# EAGLE design muxi (EAGLE 9.0.0)
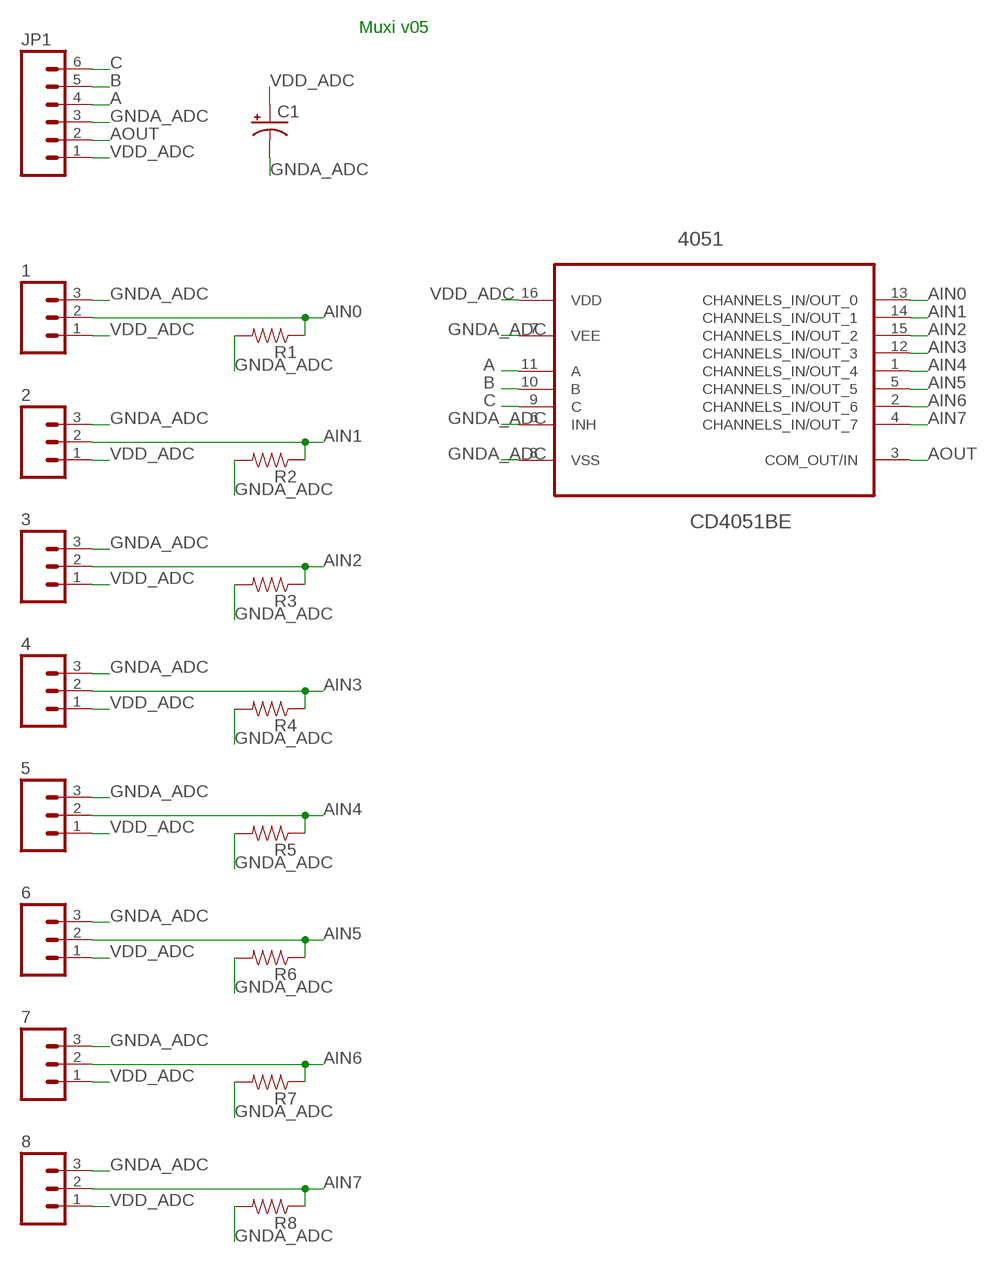
[diagram p0: schematic, sheet 1]

## Parts
1  M03PTH  [1X03]
2  M03PTH  [1X03]
3  M03PTH  [1X03]
4  M03PTH  [1X03]
5  M03PTH  [1X03]
6  M03PTH  [1X03]
7  M03PTH  [1X03]
8  M03PTH  [1X03]
4051  CD4051BE  [DIP254P762X508-16]
C1  CAP_POLPTH2  [CPOL-RADIAL-10UF-25V]
JP1  M06NO_SILK  [1X06_NO_SILK]
R1  RESISTORAXIAL-0.3  [AXIAL-0.3]
R2  RESISTORAXIAL-0.3  [AXIAL-0.3]
R3  RESISTORAXIAL-0.3  [AXIAL-0.3]
R4  RESISTORAXIAL-0.3  [AXIAL-0.3]
R5  RESISTORAXIAL-0.3  [AXIAL-0.3]
R6  RESISTORAXIAL-0.3  [AXIAL-0.3]
R7  RESISTORAXIAL-0.3  [AXIAL-0.3]
R8  RESISTORAXIAL-0.3  [AXIAL-0.3]

## Nets
A: 4051.11(A) JP1.4
AIN0: 1.2 4051.13(CHANNELS_IN/OUT_0) R1.P$1
AIN1: 2.2 4051.14(CHANNELS_IN/OUT_1) R2.P$1
AIN2: 3.2 4051.15(CHANNELS_IN/OUT_2) R3.P$1
AIN3: 4.2 4051.12(CHANNELS_IN/OUT_3) R4.P$1
AIN4: 5.2 4051.1(CHANNELS_IN/OUT_4) R5.P$1
AIN5: 6.2 4051.5(CHANNELS_IN/OUT_5) R6.P$1
AIN6: 7.2 4051.2(CHANNELS_IN/OUT_6) R7.P$1
AIN7: 8.2 4051.4(CHANNELS_IN/OUT_7) R8.P$1
AOUT: 4051.3(COM_OUT/IN) JP1.2
B: 4051.10(B) JP1.5
C: 4051.9(C) JP1.6
GNDA_ADC: 1.3 2.3 3.3 4.3 5.3 6.3 7.3 8.3 4051.6(INH) 4051.7(VEE) 4051.8(VSS) C1.2(-) JP1.3 R1.P$2 R2.P$2 R3.P$2 R4.P$2 R5.P$2 R6.P$2 R7.P$2 R8.P$2
VDD_ADC: 1.1 2.1 3.1 4.1 5.1 6.1 7.1 8.1 4051.16(VDD) C1.1(+) JP1.1

## Notes on the sheet
- Muxi v05

## Library data of the parts
1-8 = SparkFun-Connectors:M03: Header 3 Standard 3-pin 0.1" header. Use with straight break away headers (SKU : PRT-00116), right angle break away headers (PRT-00553), swiss pins (PRT-00743), machine pins (PRT-00117), and female headers (PRT-00115). Molex polarized connector foot print use with SKU : PRT-08232 with associated crimp pins and housings.
4051 = my4051:CD4051BE: The CD4051B is a single 8-Channel multiplexer having three binary control inputs.; MPN: CD4051BE; OC_FARNELL: 2135100; OC_NEWARK: 60K5119; PACKAGE: PDIP-16; SUPPLIER: Texas Instruments
C1 = SparkFun-Capacitors:CAP_POL: Capacitor Polarized These are standard SMD and PTH capacitors. Normally 10uF, 47uF, and 100uF in electrolytic and tantalum varieties. Always verify the external diameter of the through hole cap, it varies with capacity, voltage, and manufacturer. The EIA devices should be standard.
JP1 = SparkFun-Connectors:M06: Header 6 Standard 6-pin 0.1" header. Use with straight break away headers (SKU : PRT-00116), right angle break away headers (PRT-00553), swiss pins (PRT-00743), machine pins (PRT-00117), and female headers (PRT-00115). Molex polarized connector foot print use with SKU : PRT-08094 with associated crimp pins and housings. NOTES ON THE VARIANTS LOCK and LOCK_LONGPADS... This footprint was designed to help hold the alignment of a through-hole component (i.e. 6-pin header) while soldering it into place. You may notice that each hole has been shifted either up or down by 0.005 of an inch from it's more standard position (which is a perfectly straight line). This slight alteration caused the pins (the squares in the middle) to touch the edges of the holes. Because they are alternating, it causes a "brace" to hold the component in place. 0.005 has proven to be the perfect amount of "off-center" position when using our standard breakaway headers. Although looks a little odd when you look at the bare footprint, once you have a header in there, the alteration is very hard to notice. Also,if you push a header all the way into place, it is covered up entirely on the bottom side. This idea of altering the position of holes to aid alignment will be further integrated into the Sparkfun Library for other footprints. It can help hold any component with 3 or more connection pins.
R1-R8 = SparkFun-Resistors:RESISTOR: Resistor Basic schematic elements and footprints for 0603, 1206, and PTH resistors.

## Board
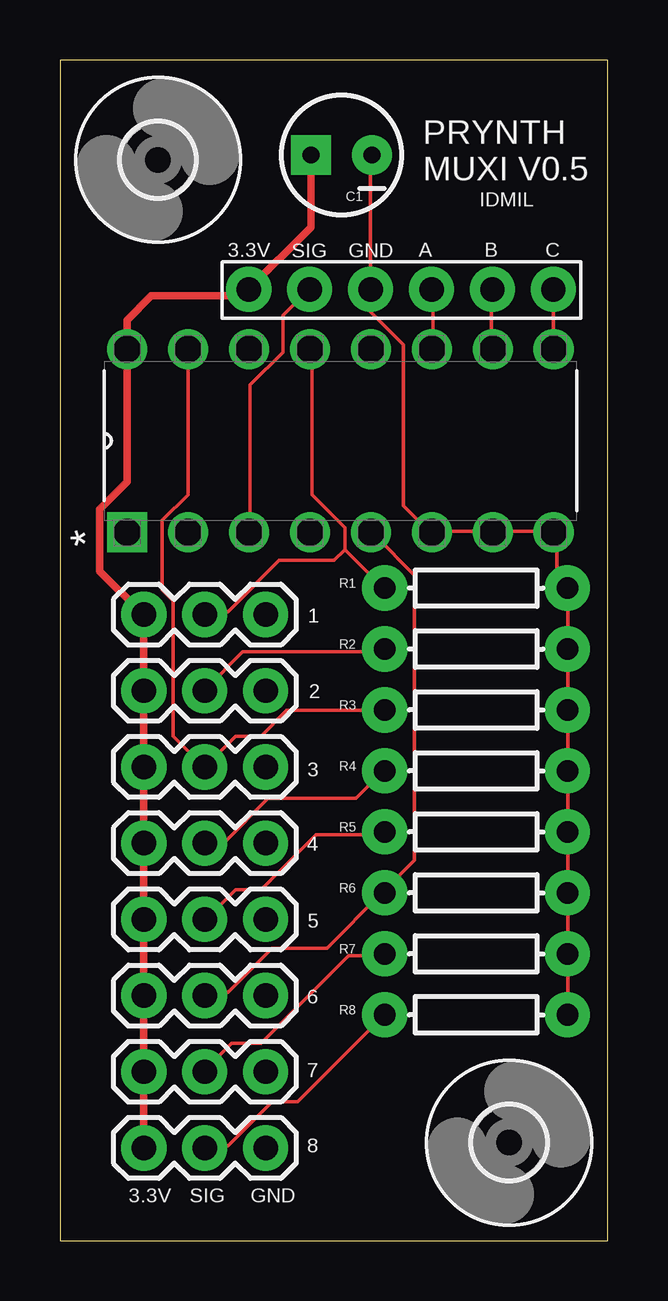
[diagram p1: board, top side]
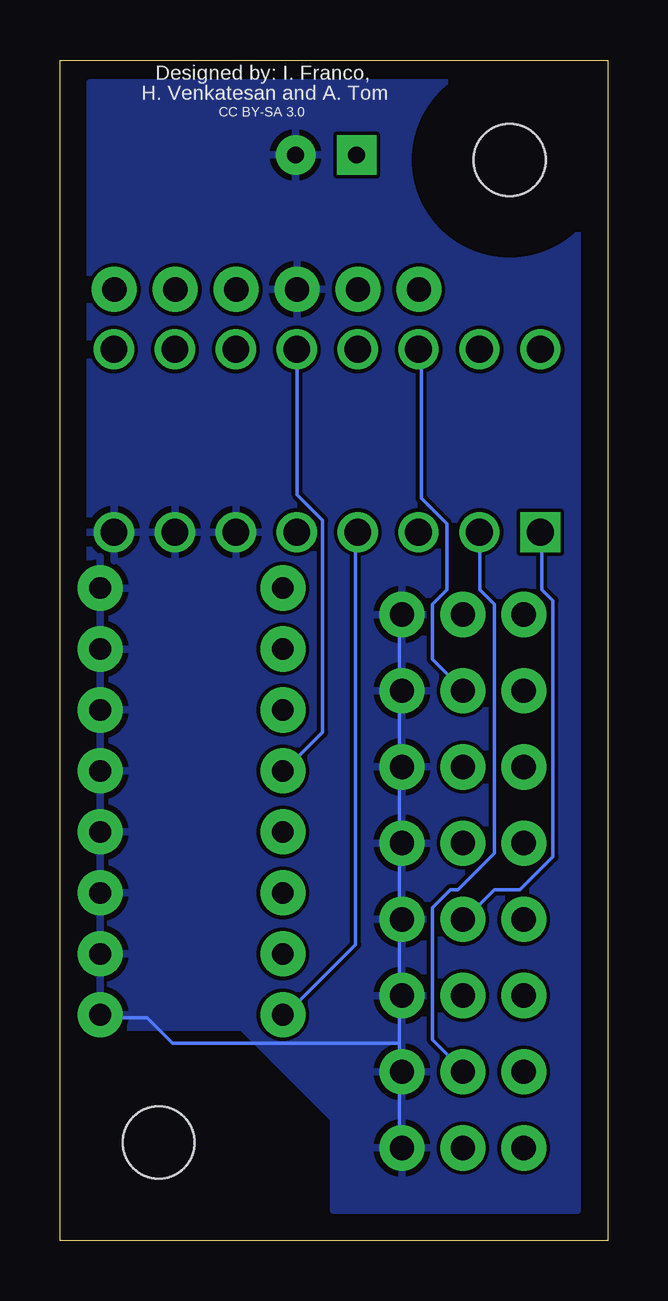
[diagram p2: board, bottom side, seen from below]

Size 22.84 x 49.2 mm. Coordinates in mm from the lower left corner, seen from the top.
Outline: 0,0 22.84,0 22.84,49.2 0,49.2 0,0
Copper layers (1*16): Top 0.035mm / dielectric 1.5mm / Bottom 0.035mm
Design rules "dirt_cheap_dirty_boards.v1.1": minimum track width 6mil, minimum drill 12mil, track to track 6mil, track to pad 6mil, pad to pad 6mil, via to via 6mil, smd to smd 0mil, copper to edge 10mil, drill to drill 10mil, minimum pad ring 10mil, minimum via ring 6mil, stop-mask expansion 2mil, vias tented up to drill 25mil, thermal gap 10mil

### Footprints (pad centres in the part's own frame; a part is rotated, then mirrored left to right if it is on the bottom)
1X03 = drill 1.016 pad 1.88: 1 0,0; 2 2.54,0; 3 5.08,0
DIP254P762X508-16 = drill 1.118 square: 1 -7.62,17.78 | drill 1.118: 2 -7.62,15.24; 3 -7.62,12.7; 4 -7.62,10.16; 5 -7.62,7.62; 6 -7.62,5.08; 7 -7.62,2.54; 8 -7.62,0; 9 0,0; 10 0,2.54; 11 0,5.08; 12 0,7.62; 13 0,10.16; 14 0,12.7; 15 0,15.24; 16 0,17.78
CPOL-RADIAL-10UF-25V = drill 0.7 pad 1.651 square: 1 1.27,0 | drill 0.7 pad 1.651: 2 -1.27,0
1X06_NO_SILK = drill 1.016 pad 1.88: 1 0,0; 2 2.54,0; 3 5.08,0; 4 7.62,0; 5 10.16,0; 6 12.7,0
AXIAL-0.3 = drill 0.9 pad 1.88: P$1 -3.81,0; P$2 3.81,0
3,0 = hole 3: 0,0

### Placement (x,y rotation side)
1  3.5,26.09 0 top
2  3.5,22.92 0 top
3  3.5,19.74 0 top
4  3.5,16.57 0 top
5  3.5,13.39 0 top
6  3.5,10.22 0 top
7  3.5,7.04 0 top
8  3.5,3.87 0 top
4051  20.59,37.14 90 top
C1  11.74,45.24 180 top
JP1  7.87,39.64 0 top
R1  17.35,27.2 0 top
R2  17.35,24.66 0 top
R3  17.35,22.12 0 top
R4  17.35,19.58 0 top
R5  17.35,17.04 0 top
R6  17.35,14.5 0 top
R7  17.35,11.96 0 top
R8  17.35,9.42 0 top
U$1  [3,0]  4.09,45.04 0 top
U$2  [3,0]  18.73,4.09 0 top

### Tracks (layer width: path | path; a pad name or v marks a point on that pad's centre or on a via)
A
  Top 0.152: 4051.11 15.54,37.19 15.54,39.62 JP1.4
AIN0
  Top 0.152: 11.89,28.8 11.89,29.72 10.52,31.09 10.52,37.03 4051.13 | 11.89,28.8 13.41,27.28 R1.P$1 | 11.89,28.8 11.43,28.35 9.14,28.35 7.01,26.21 6.1,26.21 1.2
AIN1
  Top 0.152: R2.P$1 13.41,24.54 7.62,24.54 6.1,23.01 2.2
  Bottom 0.152: 4051.14 7.77,37.03 7.77,30.94 6.71,29.87 6.71,27.13 7.32,26.52 7.32,24.23 6.1,23.01 2.2
AIN2
  Top 0.152: 4051.15 5.33,37.03 5.33,31.09 4.27,30.02 4.27,27.13 4.72,26.67 4.72,21.03 5.94,19.81 3.2 6.1,19.81 7.32,21.03 8.38,21.03 9.45,22.1 13.41,22.1 R3.P$1
AIN3
  Top 0.152: 4.2 6.1,16.61 6.86,16.61 8.69,18.44 12.34,18.44 13.41,19.51 R4.P$1
  Bottom 0.152: 4051.12 12.95,37.03 12.95,31.09 11.89,30.02 11.89,21.18 13.41,19.66 R4.P$1
AIN4
  Top 0.152: R5.P$1 13.41,16.92 10.67,16.92 8.38,14.63 7.32,14.63 6.1,13.41 5.2
  Bottom 0.152: 4051.1 2.74,29.41 2.74,27.13 2.29,26.67 2.29,16 3.66,14.63 4.72,14.63 5.94,13.41 5.2
AIN5
  Top 0.152: 4051.5 13.11,29.41 14.78,27.74 14.78,15.85 13.56,14.63 R6.P$1 13.41,14.48 11.12,12.19 8.84,12.19 7.01,10.36 6.1,10.36 6.2
AIN6
  Top 0.152: R7.P$1 13.41,11.89 12.04,11.89 8.38,8.23 7.16,8.23 6.1,7.16 7.2
  Bottom 0.152: 4051.2 5.33,29.41 5.33,27.13 4.72,26.52 4.72,16.15 6.25,14.63 6.55,14.63 7.32,13.87 7.32,8.38 6.1,7.16 7.2
AIN7
  Top 0.152: 8.2 6.1,3.96 7.01,3.96 8.84,5.79 9.91,5.79 13.41,9.3 R8.P$1
  Bottom 0.152: 4051.4 10.52,29.41 10.52,12.34 13.41,9.45 R8.P$1
AOUT
  Top 0.152: 4051.3 7.92,29.57 7.92,35.66 9.3,37.03 9.3,38.56 10.36,39.62 JP1.2
B
  Top 0.152: 4051.10 17.98,37.19 17.98,39.62 JP1.5
C
  Top 0.152: 4051.9 20.57,37.19 20.57,39.62 JP1.6
GNDA_ADC
  Top 0.152: R8.P$2 21.18,9.45 21.18,11.89 R7.P$2 21.18,12.04 21.18,14.48 R6.P$2 21.18,14.63 21.18,16.92 R5.P$2 21.18,17.07 21.18,19.51 R4.P$2 21.18,19.66 21.18,22.1 R3.P$2 21.18,22.25 21.18,24.54 R2.P$2 21.18,24.69 21.18,27.13 R1.P$2 21.03,27.28 20.73,27.58 20.73,29.41 4051.8 20.57,29.57 18.14,29.57 4051.7 17.98,29.57 15.54,29.57 4051.6 15.39,29.57 14.33,30.63 14.33,37.34 12.95,38.71 12.95,39.62 JP1.3 12.95,39.78 12.95,45.11 C1.2
  Bottom 0.152: 1.3 8.69,26.06 8.69,23.01 2.3 8.69,22.86 8.69,19.81 3.3 8.69,19.66 8.69,16.61 4.3 8.69,16.46 8.69,13.41 5.3 8.69,13.26 8.69,10.36 6.3 8.69,10.21 8.69,8.23 | 8.3 8.69,3.96 8.69,7.01 7.3 8.69,7.16 8.69,8.23 | 8.69,8.23 18.14,8.23 19.2,9.3 21.03,9.3 R8.P$2
  pour Bottom: 1.27,48.26 21.59,48.26 21.59,8.89 15.24,8.89 11.43,5.08 11.43,1.27 1.27,1.27
VDD_ADC
  Top 0.152: 3.5,26.06 1.1 | 6.1
  Top 0.305: C1.1 10.47,42.24 JP1.1 7.6,39.37 3.81,39.37 2.81,38.37 4051.16 2.81,31.63 1.66,30.49 1.66,27.9 3.5,26.06 | 1.1 2.1 3.1 4.1 5.1 6.1 | 6.1 7.1 8.1

### Text on the board
tNames: PRYNTH / MUXI V0.5 | IDMIL | 3.3V | SIG | GND | A | B | C | 3.3V | SIG | GND
bNames: Designed by: I. Franco, | H. Venkatesan and A. Tom | CC BY-SA 3.0